# Altium schematic sheet 01_USB_CHARGER.SchDoc
size A; SheetNumber: 2; SheetTotal: 7
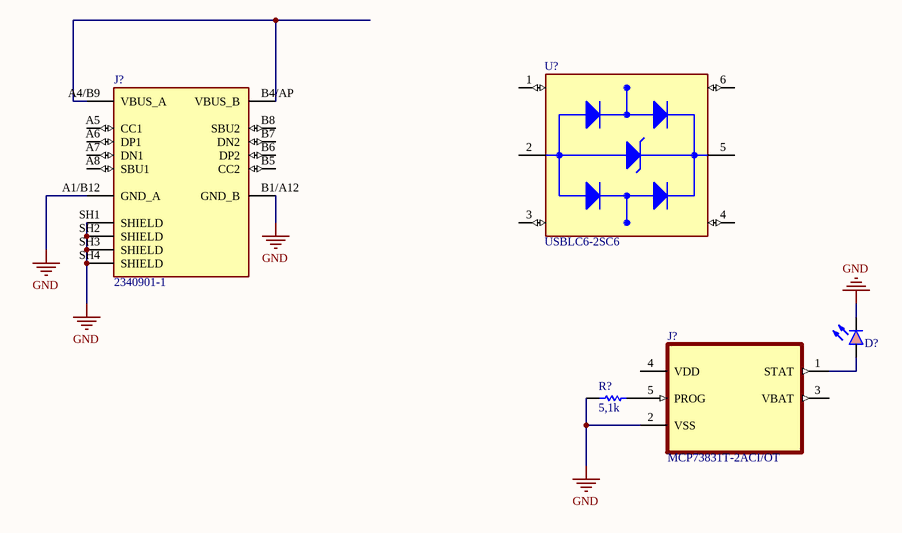
[diagram p0: 01_USB_CHARGER.SchDoc]

## Parts
(Parts that share a designator on the sheet are numbered #1, #2 ... from top to bottom, then left to right.)
D?  LED RED  [LED 10MM - RED]  (value not drawn)
J?#1  2340901-1  [TE_2340901-1]
J?#2  MCP73831T-2ACI/OT  [SOT95P280X145-5N]
R?  5,1k  [RESC3216L]
U?  USBLC6-2SC6  [SOT95P280X145-6N]

## Nets
GND: D?.2(K) J?#1.A1/B12(GND_A) J?#1.B1/A12(GND_B) J?#1.SH1(SHIELD) J?#1.SH2(SHIELD) J?#1.SH3(SHIELD) J?#1.SH4(SHIELD) J?#2.2(VSS) R?.1
NetD?_1: D?.1(A) J?#2.1(STAT)
NetJ?#1_A4/B9: J?#1.A4/B9(VBUS_A) J?#1.B4/AP(VBUS_B)
NetJ?#2_5: J?#2.5(PROG) R?.2

Not connected (* = marked no-connect by the designer): J?#1 A5(CC1) A6(DP1) A7(DN1) A8(SBU1) B5(CC2) B6(DP2) B7(DN2) B8(SBU2); J?#2 3(VBAT) 4(VDD); U? 1(I/O1_IN) 2(GND) 3(I/O2_IN) 4(I/O2_OUT) 5(VBUS) 6(I/O1_OUT)

## Library data of the parts
D? = LED RED: Typical LED 3-pin 2-color
J?#1 = 2340901-1: USB Type C 2.0 Conn Rec Mid-Mount One Ro; MF: TE Connectivity; SnapEDA_Link: https://www.snapeda.com/parts/2340901-1/TE+Connectivity/view-part/?ref=snap; Package: None; Value: *; MP: 2340901-1; Check_prices: https://www.snapeda.com/parts/2340901-1/TE+Connectivity/view-part/?ref=eda
J?#2 = MCP73831T-2ACI/OT: Charger IC Lithium Ion/Polymer SOT-23-5; MF: Microchip; Package: SOT-23 Microchip; Purchase-URL: https://pricing.snapeda.com/search/part/MCP73831T-2ACI/OT/?ref=eda; MP: MCP73831T-2ACI/OT; Value: *; Availability: In Stock; SnapEDA_Link: https://www.snapeda.com/parts/MCP73831T-2ACI/OT/Microchip/view-part/?ref=snap; Price: None; Check_prices: https://www.snapeda.com/parts/MCP73831T-2ACI/OT/Microchip/view-part/?ref=eda
R? = Resistor: Semiconductor Resistor; Published: 8-Jun-2000; LatestRevisionDate: 17-Jul-2002; LatestRevisionNote: Re-released for DXP Platform.; PackageReference: AXIAL-0.5; Publisher: Altium Limited
U? = USBLC6-2SC6: 17V Clamp 5A (8/20Âµs) Ipp Tvs Diode Surface Mount SOT-23-6; MF: STMicroelectronics; Value: *; SnapEDA_Link: https://www.snapeda.com/parts/USBLC6-2SC6/STMicroelectronics/view-part/?ref=snap; Check_prices: https://www.snapeda.com/parts/USBLC6-2SC6/STMicroelectronics/view-part/?ref=eda; Purchase-URL: https://pricing.snapeda.com/search/part/USBLC6-2SC6/?ref=eda; Price: None; Availability: In Stock; Package: SOT-23-6 STMicroelectronics; MP: USBLC6-2SC6